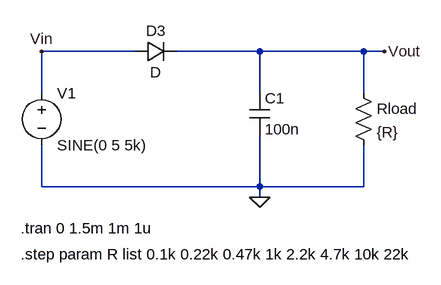
[diagram p0: schematic p7_prev1_d.asc]
p7_prev1_d.asc, the LTspice schematic file:
Version 4
SHEET 1 880 680
WIRE 96 80 -48 80
WIRE 288 80 160 80
WIRE 448 80 288 80
WIRE 480 80 448 80
WIRE -48 144 -48 80
WIRE 288 144 288 80
WIRE 448 144 448 80
WIRE -48 288 -48 224
WIRE 288 288 288 208
WIRE 288 288 -48 288
WIRE 448 288 448 224
WIRE 448 288 288 288
WIRE 288 304 288 288
FLAG 480 80 Vout
FLAG -48 80 Vin
FLAG 288 304 0
SYMBOL voltage -48 128 R0
WINDOW 123 0 0 Left 0
WINDOW 39 0 0 Left 0
SYMATTR InstName V1
SYMATTR Value SINE(0 5 5k)
SYMBOL diode 96 96 R270
WINDOW 0 32 32 VTop 2
WINDOW 3 0 32 VBottom 2
SYMATTR InstName D3
SYMBOL cap 272 144 R0
SYMATTR InstName C1
SYMATTR Value 100n
SYMBOL res 432 128 R0
SYMATTR InstName Rload
SYMATTR Value {R}
TEXT -80 392 Left 2 !.step param R list 0.1k 0.22k 0.47k 1k 2.2k 4.7k 10k 22k
TEXT -80 352 Left 2 !.tran 0 1.5m 1m 1u

The netlist it stands for:
* p7_prev1_d.asc
V1 Vin 0 SINE(0 5 5k)
D3 Vin Vout D
C1 Vout 0 100n
Rload Vout 0 {R}
.model D D
.lib standard.dio
.step param R list 0.1k 0.22k 0.47k 1k 2.2k 4.7k 10k 22k
.tran 0 1.5m 1m 1u
.backanno
.end

* Results of the author's LTspice run, read from the files saved beside the schematic
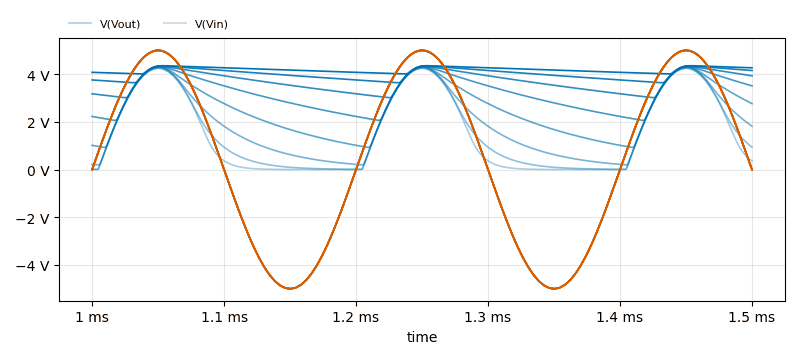
[diagram p1: Transient Analysis of p7_prev1_d.asc, plotted from the saved traces]
* Transient Analysis, 8 runs:
*   V(Vout) [r=100]: min 13.06 µV, max 4.247 V, average 1.527 V, rms 2.236 V, last 365.6 mV
*   V(Vout) [r=220]: min 8.601 mV, max 4.266 V, average 1.654 V, rms 2.283 V, last 937.7 mV
*   V(Vout) [r=470]: min 198.1 mV, max 4.286 V, average 1.991 V, rms 2.439 V, last 1.818 V
*   V(Vout) [r=1000]: min 929.3 mV, max 4.305 V, average 2.564 V, rms 2.792 V, last 2.766 V
*   V(Vout) [r=2200]: min 2.061 V, max 4.323 V, average 3.21 V, rms 3.291 V, last 3.51 V
*   V(Vout) [r=4700]: min 3.015 V, max 4.338 V, average 3.697 V, rms 3.721 V, last 3.933 V
*   V(Vout) [r=10000]: min 3.643 V, max 4.349 V, average 4.007 V, rms 4.013 V, last 4.155 V
*   V(Vout) [r=22000]: min 4.012 V, max 4.356 V, average 4.188 V, rms 4.19 V, last 4.268 V
*   V(Vin) [r=100]: min -5 V, max 5 V, average 634.7 mV, rms 3.534 V, last 0 V
*   V(Vin) [r=220]: min -5 V, max 4.998 V, average 635.8 mV, rms 3.535 V, last 0 V
*   V(Vin) [r=470]: min -5 V, max 5 V, average 636.7 mV, rms 3.536 V, last 0 V
*   V(Vin) [r=1000]: min -5 V, max 5 V, average 636.8 mV, rms 3.536 V, last 0 V
*   V(Vin) [r=2200]: min -4.999 V, max 4.999 V, average 636.8 mV, rms 3.536 V, last 0 V
*   V(Vin) [r=4700]: min -4.999 V, max 4.999 V, average 636.7 mV, rms 3.536 V, last 0 V
*   V(Vin) [r=10000]: min -4.999 V, max 4.999 V, average 636.7 mV, rms 3.537 V, last 0 V
*   V(Vin) [r=22000]: min -4.999 V, max 4.999 V, average 636.9 mV, rms 3.537 V, last 0 V